# Altium schematic sheet Sch_pwr_brd_pwr_sys.SchDoc
size Letter
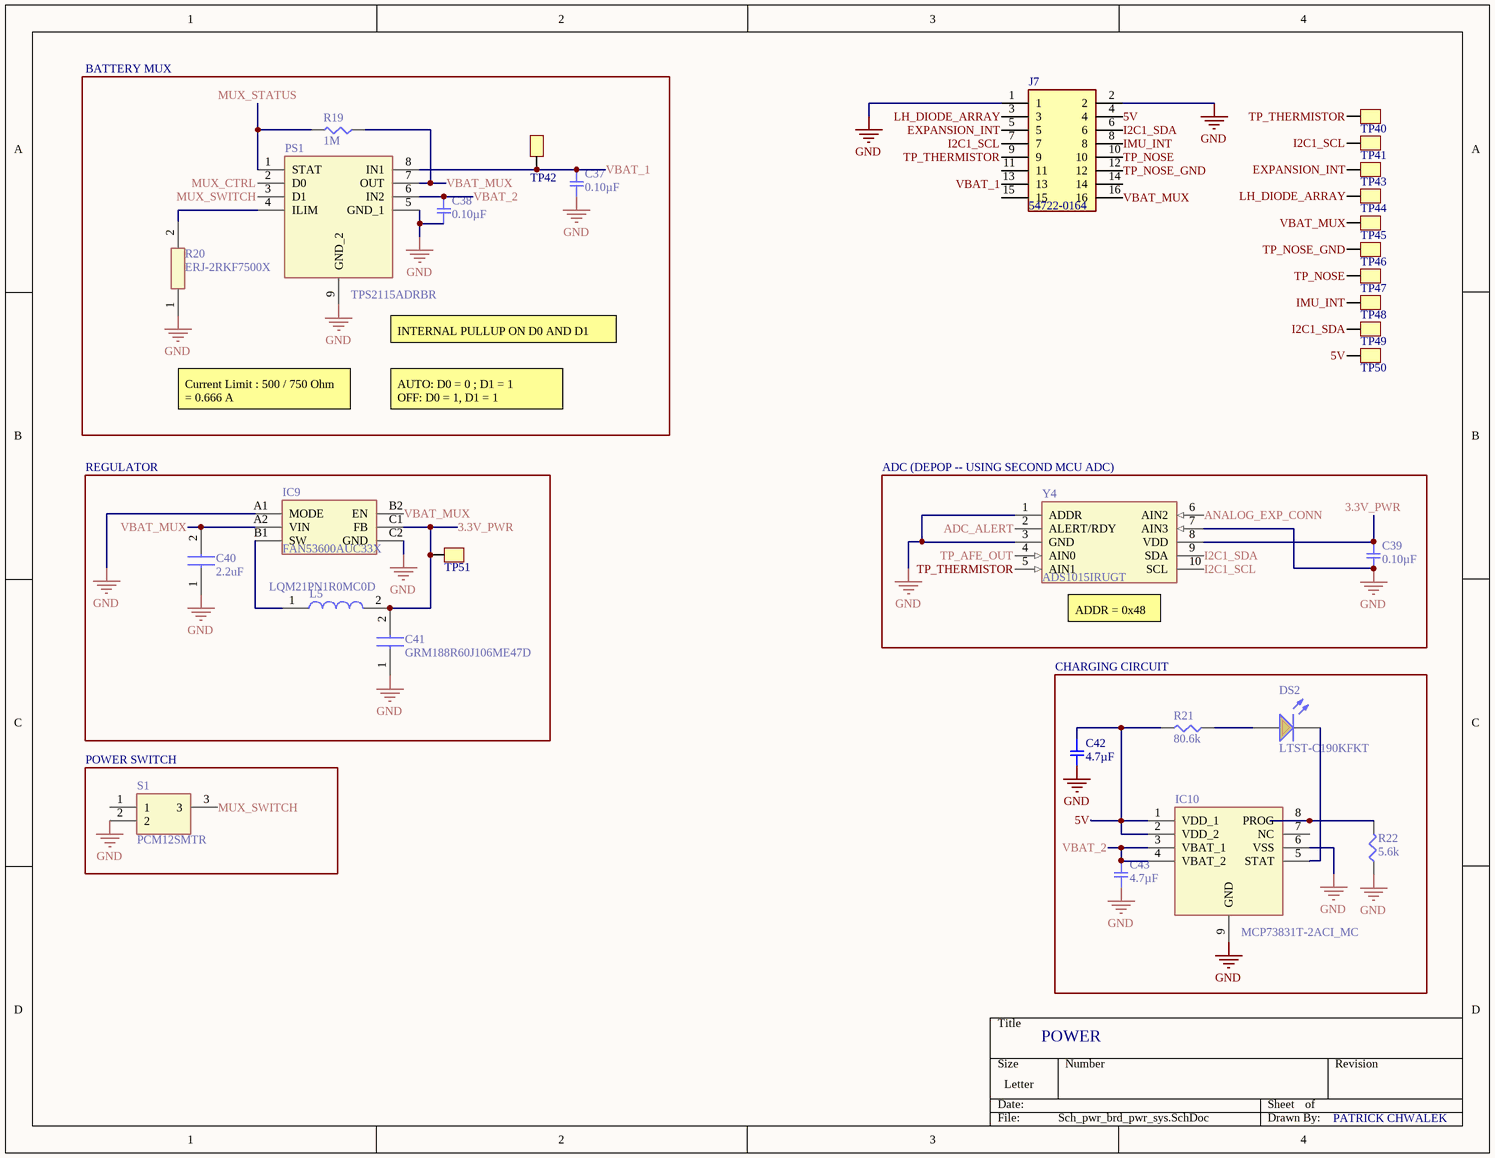
[diagram p0: Sch_pwr_brd_pwr_sys.SchDoc]

## Parts
C37  0.10µF  [SMD-0402C]
C38  0.10µF  [SMD-0402C]
C39  0.10µF  [SMD-0402C]
C40  2.2uF  [CAPC1005X55N]
C41  GRM188R60J106ME47D  [CAPC1608X09N]
C42  4.7µF  [SMD-0402C]
C43  4.7µF  [SMD-0402C]
DS2  LTST-C190KFKT  [LTST-C190KFKT_V]
IC9  FAN53600AUC33X  [BGA6C40P2X3_86X116X62]
IC10  MCP73831T-2ACI_MC  [SON50P300X200X100-9N-D]
J7  54722-0164  [54722-0164]
L5  LQM21PN1R0MC0D  [INDC2012X55N]
PS1  TPS2115ADRBR  [SON65P300X300X100-9N-D]
R19  1M  [SMD-0402-RES]
R20  ERJ-2RKF7500X  [RESC1005X40N]
R21  80.6k  [SMD-0402-RES]
R22  5.6k  [SMD-0402-RES]
S1  PCM12SMTR  [PCM12SMTR_1]
TP40  TestPoint  [TestPoint_0.4mm]  (value not drawn)
TP41  TestPoint  [TestPoint_0.4mm]  (value not drawn)
TP42  TestPoint  [TestPoint_0.4mm]  (value not drawn)
TP43  TestPoint  [TestPoint_0.4mm]  (value not drawn)
TP44  TestPoint  [TestPoint_0.4mm]  (value not drawn)
TP45  TestPoint  [TestPoint_0.4mm]  (value not drawn)
TP46  TestPoint  [TestPoint_0.4mm]  (value not drawn)
TP47  TestPoint  [TestPoint_0.4mm]  (value not drawn)
TP48  TestPoint  [TestPoint_0.4mm]  (value not drawn)
TP49  TestPoint  [TestPoint_0.4mm]  (value not drawn)
TP50  TestPoint  [TestPoint_0.4mm]  (value not drawn)
TP51  TestPoint  [TestPoint_0.4mm]  (value not drawn)
Y4  ADS1015IRUGT  [ADS7142IRUGT]

## Blocks framed on the sheet
BATTERY MUX: C37 C38 PS1 R19 R20 TP42
REGULATOR: C40 C41 IC9 L5 TP51
ADC (DEPOP -- USING SECOND MCU ADC): C39 Y4
CHARGING CIRCUIT: C42 C43 DS2 IC10 R21 R22
POWER SWITCH: S1

## Nets
GND: C37.2 C38.2 C39.2 C40.1 C41.1 C42.2 C43.2 IC9.A1(MODE) IC9.C2(GND) IC10.6(VSS) IC10.9(GND) J7.1 J7.2 PS1.5(GND_1) PS1.9(GND_2) R20.1 R22.1 S1.2 Y4.1(ADDR) Y4.3(GND) Y4.7(AIN3)
3.3V_PWR: C39.1 C41.2 IC9.C1(FB) L5.2 TP51.1 Y4.8(VDD)
5V: C42.1 IC10.1(VDD_1) IC10.2(VDD_2) J7.4 R21.2 TP50.1
ADC_ALERT: Y4.2(ALERT/RDY)
ANALOG_EXP_CONN: Y4.6(AIN2)
EXPANSION_INT: J7.5 TP43.1
I2C1_SCL: J7.7 TP41.1 Y4.10(SCL)
I2C1_SDA: J7.6 TP49.1 Y4.9(SDA)
IMU_INT: J7.8 TP48.1
LH_DIODE_ARRAY: J7.3 TP44.1
MUX_CTRL: PS1.2(D0)
MUX_STATUS: PS1.1(STAT) R19.2
MUX_SWITCH: PS1.3(D1) S1.3
TP_AFE_OUT: Y4.4(AIN0)
TP_NOSE: J7.10 TP47.1
TP_NOSE_GND: J7.12 TP46.1
TP_THERMISTOR: J7.9 TP40.1 Y4.5(AIN1)
VBAT_1: C37.1 J7.13 PS1.8(IN1) TP42.1
VBAT_2: C38.1 C43.1 IC10.3(VBAT_1) IC10.4(VBAT_2) PS1.6(IN2)
VBAT_MUX: C40.2 IC9.A2(VIN) IC9.B2(EN) J7.16 PS1.7(OUT) R19.1 TP45.1
NetDS2_1: DS2.1(A) R21.1
NetDS2_2: DS2.2(K) IC10.5(STAT)
NetIC9_B1: IC9.B1(SW) L5.1
NetIC10_8: IC10.8(PROG) R22.2
NetPS1_4: PS1.4(ILIM) R20.2

Not connected (* = marked no-connect by the designer): IC10 7(NC); J7 11 14 15; S1 1

## Notes on the sheet
- (near PS1) INTERNAL PULLUP ON D0 AND D1
- Current Limit : 500 / 750 Ohm = 0.666 A
- AUTO: D0 = 0 ; D1 = 1
  OFF: D0 = 1, D1 = 1
- (near Y4) ADDR = 0x48
- POWER
- PATRICK CHWALEK

## Library data of the parts
C37-C39 = GCM155R71C104KA55D: CAP CER 0.1UF 16V X7R 0402; Manufacturer: Murata Electronics North America; Factory Stock: 0; Unit Price (USD): 0.1; Minimum Quantity: 1; Tolerance: ±10%; Datasheets: http://www.murata.com/~/media/webrenewal/support/library/catalog/products/capacitor/mlcc/c03e.ashx; Image: //media.digikey.com/Renders/Murata%20Renders/ZRB-SERIES-0402.jpg; Digi-Key Part Number: 490-4759-1-ND; Part Number: GCM155R71C104KA55D; Quantity Available: 734194; @ qty: 0; Packaging: Cut Tape (CT); Series: GCM; Part Status: Active; Value: 0.10µF; Voltage: 16V; Temperature Coefficient: X7R; Operating Temperature: -55°C ~ 125°C; Features: -; Ratings: AEC-Q200; Applications: Automotive; Mounting Type: Surface Mount, MLCC; Package / Case: 0402 (1005 Metric); Size / Dimension: 0.039" L x 0.020" W (1.00mm x 0.50mm); Height - Seated (Max): -; Thickness (Max): 0.022" (0.55mm); Lead Spacing: -; Lead Style: -
C40 = GRM155R60J225ME15D: Capacitor; Manufacturer_Name: Murata Electronics; Datasheet Link: http://www.murata.com/~/media/webrenewal/support/library/catalog/products/capacitor/mlcc/c02e.pdf; Height: 0.55mm; Manufacturer_Part_Number: GRM155R60J225ME15D; Mouser Part Number: 81-GRM155R60J225ME5D; Mouser Price/Stock: https://www.mouser.com/Search/Refine.aspx?Keyword=81-GRM155R60J225ME5D; RS Part Number: 8145227; RS Price/Stock: https://uk.rs-online.com/web/p/products/8145227
C41 = GRM188R60J106ME47D: Capacitor; Manufacturer_Name: Murata Electronics; Datasheet Link: http://psearch.en.murata.com/capacitor/product/GRM188R60J106ME47%23.pdf; Height: 0.9mm; Manufacturer_Part_Number: GRM188R60J106ME47D; Mouser Part Number: 81-GRM188R60J106ME47; Mouser Price/Stock: https://www.mouser.com/Search/Refine.aspx?Keyword=81-GRM188R60J106ME47; RS Part Number: 7235543P; RS Price/Stock: http://uk.rs-online.com/web/p/products/7235543P
C42 C43 = GRM153R60G475ME15D: CAP CER 4.7UF 4V X5R 0402; Manufacturer: Murata Electronics North America; Factory Stock: 0; Unit Price (USD): 0.27; Minimum Quantity: 1; Tolerance: ±20%; Datasheets: http://psearch.en.murata.com/capacitor/product/GRM153R60G475ME15%23.pdf; Image: //media.digikey.com/Renders/Murata%20Renders/ZRB-SERIES-0402.jpg; Digi-Key Part Number: 490-13231-1-ND; Part Number: GRM153R60G475ME15D; Quantity Available: 9100; @ qty: 0; Packaging: Cut Tape (CT); Series: GRM; Part Status: Active; Value: 4.7µF; Voltage: 4V; Temperature Coefficient: X5R; Operating Temperature: -55°C ~ 85°C; Features: -; Ratings: -; Applications: General Purpose; Mounting Type: Surface Mount, MLCC; Package / Case: 0402 (1005 Metric); Size / Dimension: 0.039" L x 0.020" W (1.00mm x 0.50mm); Height - Seated (Max): -; Thickness (Max): 0.013" (0.33mm); Lead Spacing: -; Lead Style: -
DS2 = CMP-1674-00008-1: LED Uni-Color Orange, 75 mW, 30 mA, -35 to 85 degC, 2-Pin SMD, RoHS, Tape and Reel; Resistance: 47 kohm; Power Rating: 100 mW; Case\Package: 0603; Tolerance: 1%; Voltage Rating (DC): 50 V; ComponentLink2URL: http://optoelectronics.liteon.com/upload/download/DS-22-99-0186/S_110_LTST-C190KFKT.pdf; Mount: Surface Mount; Pins: 2; Package Quantity: 5000; Max Operating Temperature: 155 degC; RoHSCompliant: true; PackageDescription: 2-Pin Surface Mount Device, Body 1.6 x 0.8 mm; Case Code (Metric): 1608; PackageReference: C190KFKT; Height: 0.45 mm; ComponentLink2Description: Datasheet; Min Operating Temperature: -55 degC; DatasheetVersion: Rev. I, 09/2011; Packaging: Tape and Reel; ComponentLink1Description: Manufacturer URL; ComponentLink1URL: http://www.us.liteon.com/; Voltage Rating: 50 V; Case Code (Imperial): 0603; Length: 1.6 mm; Width: 0.8 mm; REACH SVHC: No SVHC
IC9 = FAN53600AUC33X: Integrated Circuit; Manufacturer_Name: Fairchild Semiconductor; Datasheet Link: https://www.onsemi.com/pub/Collateral/FAN53610-D.pdf; Height: 0.625mm; Manufacturer_Part_Number: FAN53600AUC33X; Mouser Part Number: 512-FAN53600AUC33X; Mouser Price/Stock: https://www.mouser.com/Search/Refine.aspx?Keyword=512-FAN53600AUC33X
IC10 = MCP73831T-2ACI_MC: Integrated Circuit; Manufacturer_Name: Microchip; Manufacturer_Part_Number: MCP73831T-2ACI/MC; Allied_Number: 70452042; Datasheet Link: http://ww1.microchip.com/downloads/en/DeviceDoc/20001984g.pdf; Height: 1mm; Mouser Part Number: 579-MCP73831T-2ACIMC; Mouser Price/Stock: https://www.mouser.com/Search/Refine.aspx?Keyword=579-MCP73831T-2ACIMC; Allied Price/Stock: https://www.alliedelec.com/microchiptechnologyinc-mcp73831t-2aci-mc/70452042/
J7 = 54722-0164: Connector; Manufacturer_Name: Molex; Datasheet Link: http://www.molex.com/webdocs/datasheets/pdf/en-us//0547220164_PCB_RECEPTACLES.pdf; Manufacturer_Part_Number: 54722-0164; Mouser Part Number: 538-54722-0164; Mouser Price/Stock: https://www.mouser.com/Search/Refine.aspx?Keyword=538-54722-0164; RS Part Number: 7206511; RS Price/Stock: https://uk.rs-online.com/web/p/products/7206511
L5 = LQM21PN1R0MC0D: Inductor; Manufacturer_Name: Murata Electronics; Datasheet Link: https://componentsearchengine.com/Datasheets/2/LQM21PN1R0MC0D.pdf; Height: 0.55mm; Manufacturer_Part_Number: LQM21PN1R0MC0D; Mouser Part Number: 81-LQM21PN1R0MC0D; Mouser Price/Stock: https://www.mouser.com/Search/Refine.aspx?Keyword=81-LQM21PN1R0MC0D; RS Part Number: 7926388; RS Price/Stock: https://uk.rs-online.com/web/p/products/7926388
PS1 = TPS2115ADRBR: Power Supply; Manufacturer_Name: Texas Instruments; Datasheet Link: http://www.ti.com/lit/gpn/tps2115a; Height: 1mm; Manufacturer_Part_Number: TPS2115ADRBR; Mouser Part Number: 595-TPS2115ADRBR; Mouser Price/Stock: https://www.mouser.com/Search/Refine.aspx?Keyword=595-TPS2115ADRBR
R19 = ERJ-2GEJ105X: RES SMD 1M OHM 5% 1/10W 0402; Manufacturer: Panasonic Electronic Components; Factory Stock: 0; Unit Price (USD): 0.00350; @ qty: 1500; Minimum Quantity: 1; Power (Watts): 0.1W, 1/10W; Temperature Coefficient: ±200ppm/°C; Part Number: ERJ-2GEJ105X; Datasheets: http://industrial.panasonic.com/www-cgi/jvcr13pz.cgi?E+PZ+3+AOA0001+ERJ2GEJ105X+7+WW; Image: //media.digikey.com/Photos/Panasonic%20Photos/ERJ-PA2-Series.jpg; Digi-Key Part Number: P1.0MJCT-ND; Quantity Available: 1082572; Packaging: Cut Tape (CT); Series: ERJ; Part Status: Active; Value: 1M; Tolerance: ±5%; Composition: Thick Film; Features: Automotive AEC-Q200; Operating Temperature: -55°C ~ 155°C; Package / Case: 0402 (1005 Metric); Supplier Device Package: 0402; Size / Dimension: 0.039" L x 0.020" W (1.00mm x 0.50mm); Height - Seated (Max): 0.016" (0.40mm); Number of Terminations: 2; Failure Rate: -
R20 = ERJ-2RKF7500X: Resistor; Manufacturer_Name: Panasonic; Allied_Number: 70265602; Datasheet Link: https://industrial.panasonic.com/cdbs/www-data/pdf/RDA0000/AOA0000C86.pdf; Height: 0.4mm; Manufacturer_Part_Number: ERJ-2RKF7500X; Mouser Part Number: 667-ERJ-2RKF7500X; Allied Price/Stock: https://www.alliedelec.com/panasonic-erj-2rkf7500x/70265602/
R21 = ERJ-2RKF8062X: RES SMD 80.6K OHM 1% 1/10W 0402; Manufacturer: Panasonic Electronic Components; Factory Stock: 0; Unit Price (USD): 0.00496; @ qty: 1500; Minimum Quantity: 1; Power (Watts): 0.1W, 1/10W; Temperature Coefficient: ±100ppm/°C; Part Number: ERJ-2RKF8062X; Datasheets: http://industrial.panasonic.com/www-cgi/jvcr13pz.cgi?E+PZ+3+AOA0002+ERJ2RKF8062X+7+WW; Image: //media.digikey.com/Photos/Panasonic%20Photos/ERJ-PA2-Series.jpg; Digi-Key Part Number: P80.6KLCT-ND; Quantity Available: 91747; Packaging: Cut Tape (CT); Series: ERJ; Part Status: Active; Value: 80.6k; Tolerance: ±1%; Composition: Thick Film; Features: Automotive AEC-Q200; Operating Temperature: -55°C ~ 155°C; Package / Case: 0402 (1005 Metric); Supplier Device Package: 0402; Size / Dimension: 0.039" L x 0.020" W (1.00mm x 0.50mm); Height - Seated (Max): 0.016" (0.40mm); Number of Terminations: 2; Failure Rate: -
R22 = ERJ-2GEJ562X: RES SMD 5.6K OHM 5% 1/10W 0402; Manufacturer: Panasonic Electronic Components; Factory Stock: 0; Unit Price (USD): 0.00350; @ qty: 1500; Minimum Quantity: 1; Power (Watts): 0.1W, 1/10W; Temperature Coefficient: ±200ppm/°C; Part Number: ERJ-2GEJ562X; Datasheets: http://industrial.panasonic.com/www-cgi/jvcr13pz.cgi?E+PZ+3+AOA0001+ERJ2GEJ562X+7+WW; Image: //media.digikey.com/Photos/Panasonic%20Photos/ERJ-PA2-Series.jpg; Digi-Key Part Number: P5.6KJCT-ND; Quantity Available: 212112; Packaging: Cut Tape (CT); Series: ERJ; Part Status: Active; Value: 5.6k; Tolerance: ±5%; Composition: Thick Film; Features: Automotive AEC-Q200; Operating Temperature: -55°C ~ 155°C; Package / Case: 0402 (1005 Metric); Supplier Device Package: 0402; Size / Dimension: 0.039" L x 0.020" W (1.00mm x 0.50mm); Height - Seated (Max): 0.016" (0.40mm); Number of Terminations: 2; Failure Rate: -
S1 = PCM12SMTR: Switch; Manufacturer_Name: C & K COMPONENTS; Allied_Number: 70417448; Datasheet Link: http://www.farnell.com/datasheets/1789487.pdf; Manufacturer_Part_Number: PCM12SMTR; Mouser Part Number: 611-PCM12SMTR; Mouser Price/Stock: https://www.mouser.com/Search/Refine.aspx?Keyword=611-PCM12SMTR; RS Part Number: 7931721P; RS Price/Stock: http://uk.rs-online.com/web/p/products/7931721P; Allied Price/Stock: https://www.alliedelec.com/c-k-pcm12smtr/70417448/
Y4 = ADS1015IRUGT: Crystal or Oscillator; Manufacturer_Name: Texas Instruments; Datasheet Link: http://www.ti.com/lit/ds/symlink/ads1015.pdf; Height: 0mm; Manufacturer_Part_Number: ADS1015IRUGT; Mouser Part Number: 595-ADS1015IRUGT; Mouser Price/Stock: https://www.mouser.com/Search/Refine.aspx?Keyword=595-ADS1015IRUGT; RS Part Number: 7321496; RS Price/Stock: https://uk.rs-online.com/web/p/products/7321496